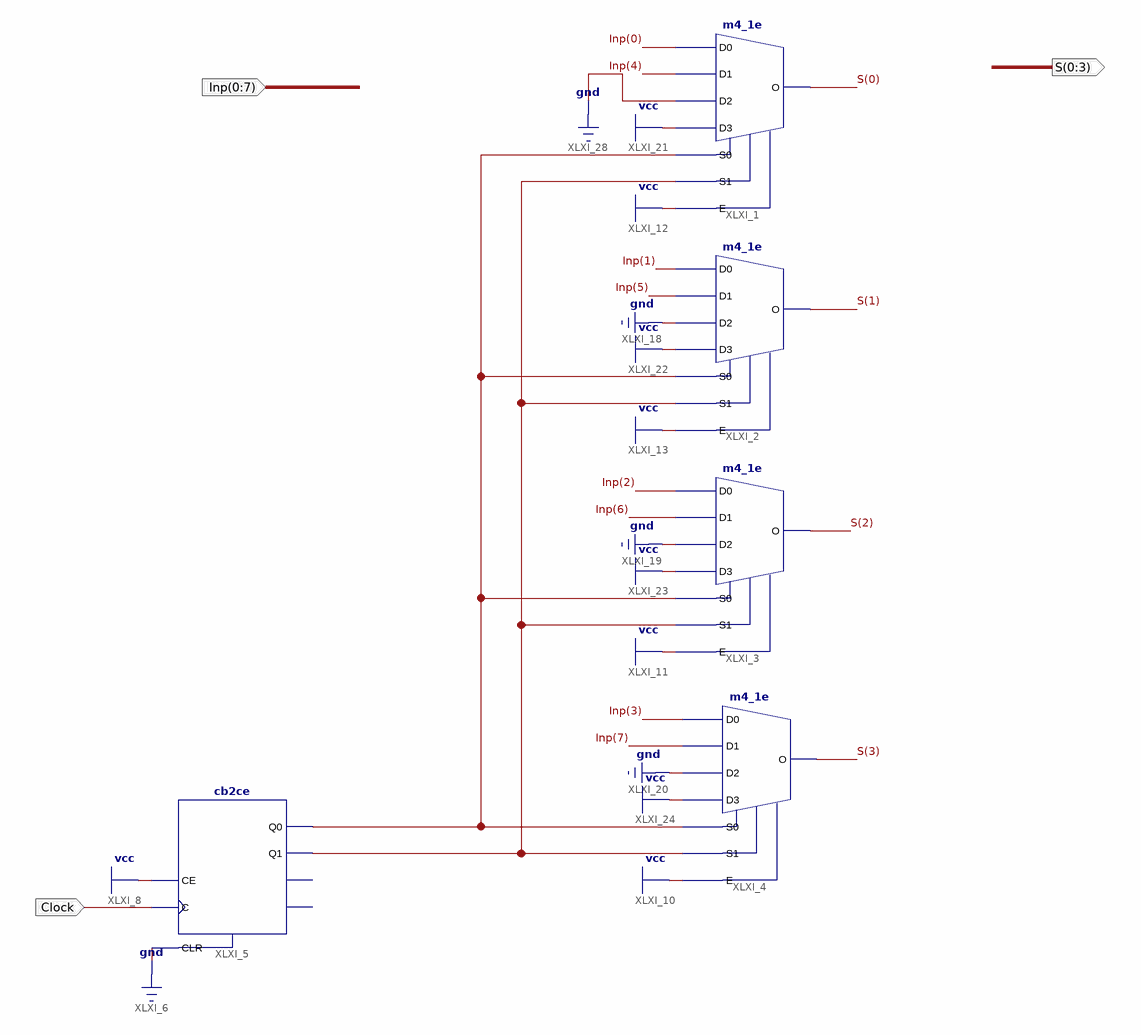
[diagram p0: schematic sheet 1]
// Xilinx ISE schematic Mux16.sch (spartan6) as structural Verilog: 5 symbols, 3 ports
module Mux16 (
  input  [0:7] Inp,
  input  Clock,
  output [0:3] S
);

  wire XLXN_42, XLXN_43;

  m4_1e XLXI_1 (.D0(Inp[0]), .D1(Inp[4]), .D2(1'b0), .D3(1'b1), .E(1'b1), .S0(XLXN_43), .S1(XLXN_42), .O(S[0]));
  m4_1e XLXI_2 (.D0(Inp[1]), .D1(Inp[5]), .D2(1'b0), .D3(1'b1), .E(1'b1), .S0(XLXN_43), .S1(XLXN_42), .O(S[1]));
  m4_1e XLXI_3 (.D0(Inp[2]), .D1(Inp[6]), .D2(1'b0), .D3(1'b1), .E(1'b1), .S0(XLXN_43), .S1(XLXN_42), .O(S[2]));
  m4_1e XLXI_4 (.D0(Inp[3]), .D1(Inp[7]), .D2(1'b0), .D3(1'b1), .E(1'b1), .S0(XLXN_43), .S1(XLXN_42), .O(S[3]));
  cb2ce XLXI_5 (.C(Clock), .CE(1'b1), .CLR(1'b0), .Q0(XLXN_43), .Q1(XLXN_42));  // open: CEO, TC
endmodule
